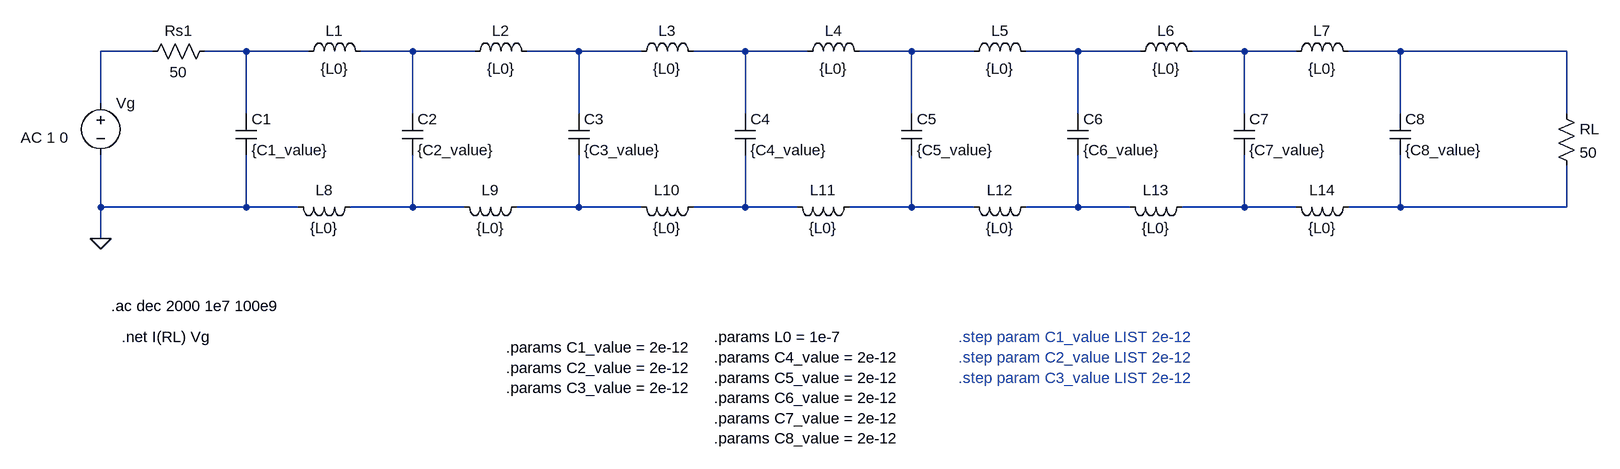
[diagram p0: schematic prototypes.asc]
prototypes.asc, the LTspice schematic file:
Version 4
SHEET 1 2384 1776
WIRE 144 720 64 720
WIRE 288 720 224 720
WIRE 384 720 288 720
WIRE 544 720 464 720
WIRE 640 720 544 720
WIRE 800 720 720 720
WIRE 896 720 800 720
WIRE 1056 720 976 720
WIRE 1152 720 1056 720
WIRE 1312 720 1232 720
WIRE 1408 720 1312 720
WIRE 1568 720 1488 720
WIRE 1664 720 1568 720
WIRE 1824 720 1744 720
WIRE 1904 720 1824 720
WIRE 2064 720 1984 720
WIRE 2320 720 2064 720
WIRE 64 800 64 720
WIRE 288 816 288 720
WIRE 544 816 544 720
WIRE 800 816 800 720
WIRE 1056 816 1056 720
WIRE 1312 816 1312 720
WIRE 1568 816 1568 720
WIRE 1824 816 1824 720
WIRE 2064 816 2064 720
WIRE 2320 816 2320 720
WIRE 64 960 64 880
WIRE 288 960 288 880
WIRE 288 960 64 960
WIRE 368 960 288 960
WIRE 544 960 544 880
WIRE 544 960 448 960
WIRE 624 960 544 960
WIRE 800 960 800 880
WIRE 800 960 704 960
WIRE 896 960 800 960
WIRE 1056 960 1056 880
WIRE 1056 960 976 960
WIRE 1136 960 1056 960
WIRE 1312 960 1312 880
WIRE 1312 960 1216 960
WIRE 1408 960 1312 960
WIRE 1568 960 1568 880
WIRE 1568 960 1488 960
WIRE 1648 960 1568 960
WIRE 1824 960 1824 880
WIRE 1824 960 1728 960
WIRE 1904 960 1824 960
WIRE 2064 960 2064 880
WIRE 2064 960 1984 960
WIRE 2320 960 2320 896
WIRE 2320 960 2064 960
WIRE 64 1008 64 960
FLAG 64 1008 0
SYMBOL Voltage 64 784 R0
WINDOW 3 -232 103 Left 2
WINDOW 123 -123 69 Left 2
SYMATTR InstName Vg
SYMATTR Value ""
SYMATTR Value2 AC 1 0
SYMBOL Res 240 704 R90
WINDOW 0 0 56 VBottom 2
WINDOW 3 32 56 VTop 2
SYMATTR InstName Rs1
SYMATTR Value 50
SYMBOL cap 272 816 R0
SYMATTR InstName C1
SYMATTR Value {C1_value}
SYMBOL cap 528 816 R0
SYMATTR InstName C2
SYMATTR Value {C2_value}
SYMBOL ind 368 736 R270
WINDOW 0 32 56 VTop 2
WINDOW 3 5 56 VBottom 2
SYMATTR InstName L1
SYMATTR Value {L0}
SYMBOL cap 784 816 R0
SYMATTR InstName C3
SYMATTR Value {C3_value}
SYMBOL ind 624 736 R270
WINDOW 0 32 56 VTop 2
WINDOW 3 5 56 VBottom 2
SYMATTR InstName L2
SYMATTR Value {L0}
SYMBOL cap 1040 816 R0
SYMATTR InstName C4
SYMATTR Value {C4_value}
SYMBOL ind 880 736 R270
WINDOW 0 32 56 VTop 2
WINDOW 3 5 56 VBottom 2
SYMATTR InstName L3
SYMATTR Value {L0}
SYMBOL cap 1296 816 R0
SYMATTR InstName C5
SYMATTR Value {C5_value}
SYMBOL ind 1136 736 R270
WINDOW 0 32 56 VTop 2
WINDOW 3 5 56 VBottom 2
SYMATTR InstName L4
SYMATTR Value {L0}
SYMBOL Res 2304 800 R0
SYMATTR InstName RL
SYMATTR Value 50
SYMBOL cap 1552 816 R0
SYMATTR InstName C6
SYMATTR Value {C6_value}
SYMBOL ind 1392 736 R270
WINDOW 0 32 56 VTop 2
WINDOW 3 5 56 VBottom 2
SYMATTR InstName L5
SYMATTR Value {L0}
SYMBOL cap 1808 816 R0
SYMATTR InstName C7
SYMATTR Value {C7_value}
SYMBOL ind 1648 736 R270
WINDOW 0 32 56 VTop 2
WINDOW 3 5 56 VBottom 2
SYMATTR InstName L6
SYMATTR Value {L0}
SYMBOL cap 2048 816 R0
SYMATTR InstName C8
SYMATTR Value {C8_value}
SYMBOL ind 1888 736 R270
WINDOW 0 32 56 VTop 2
WINDOW 3 5 56 VBottom 2
SYMATTR InstName L7
SYMATTR Value {L0}
SYMBOL ind 464 944 R90
WINDOW 0 5 56 VBottom 2
WINDOW 3 32 56 VTop 2
SYMATTR InstName L8
SYMATTR Value {L0}
SYMBOL ind 720 944 R90
WINDOW 0 5 56 VBottom 2
WINDOW 3 32 56 VTop 2
SYMATTR InstName L9
SYMATTR Value {L0}
SYMBOL ind 992 944 R90
WINDOW 0 5 56 VBottom 2
WINDOW 3 32 56 VTop 2
SYMATTR InstName L10
SYMATTR Value {L0}
SYMBOL ind 1232 944 R90
WINDOW 0 5 56 VBottom 2
WINDOW 3 32 56 VTop 2
SYMATTR InstName L11
SYMATTR Value {L0}
SYMBOL ind 1504 944 R90
WINDOW 0 5 56 VBottom 2
WINDOW 3 32 56 VTop 2
SYMATTR InstName L12
SYMATTR Value {L0}
SYMBOL ind 1744 944 R90
WINDOW 0 5 56 VBottom 2
WINDOW 3 32 56 VTop 2
SYMATTR InstName L13
SYMATTR Value {L0}
SYMBOL ind 2000 944 R90
WINDOW 0 5 56 VBottom 2
WINDOW 3 32 56 VTop 2
SYMATTR InstName L14
SYMATTR Value {L0}
TEXT 80 1112 Left 2 !.ac dec 2000 1e7 100e9
TEXT 96 1160 Left 2 !.net I(RL) Vg
TEXT 1008 1160 Left 2 !.params L0 = 1e-7\n.params C4_value = 2e-12\n.params C5_value = 2e-12\n.params C6_value = 2e-12\n.params C7_value = 2e-12\n.params C8_value = 2e-12
TEXT 1384 1160 Left 2 ;.step param C1_value LIST 2e-12\n.step param C2_value LIST 2e-12\n.step param C3_value LIST 2e-12
TEXT 688 1176 Left 2 !.params C1_value = 2e-12\n.params C2_value = 2e-12\n.params C3_value = 2e-12

The netlist it stands for:
* prototypes.asc
Vg N001 0 AC 1 0
Rs1 N002 N001 50
C1 N002 0 {C1_value}
C2 N003 N010 {C2_value}
L1 N002 N003 {L0}
C3 N004 N011 {C3_value}
L2 N003 N004 {L0}
C4 N005 N012 {C4_value}
L3 N004 N005 {L0}
C5 N006 N013 {C5_value}
L4 N005 N006 {L0}
RL N009 N016 50
C6 N007 N014 {C6_value}
L5 N006 N007 {L0}
C7 N008 N015 {C7_value}
L6 N007 N008 {L0}
C8 N009 N016 {C8_value}
L7 N008 N009 {L0}
L8 N010 0 {L0}
L9 N011 N010 {L0}
L10 N012 N011 {L0}
L11 N013 N012 {L0}
L12 N014 N013 {L0}
L13 N015 N014 {L0}
L14 N016 N015 {L0}
.ac dec 2000 1e7 100e9
.net I(RL) Vg
.params L0 = 1e-7
.params C4_value = 2e-12
.params C5_value = 2e-12
.params C6_value = 2e-12
.params C7_value = 2e-12
.params C8_value = 2e-12
* .step param C1_value LIST 2e-12
* .step param C2_value LIST 2e-12
* .step param C3_value LIST 2e-12
.params C1_value = 2e-12
.params C2_value = 2e-12
.params C3_value = 2e-12
.backanno
.end